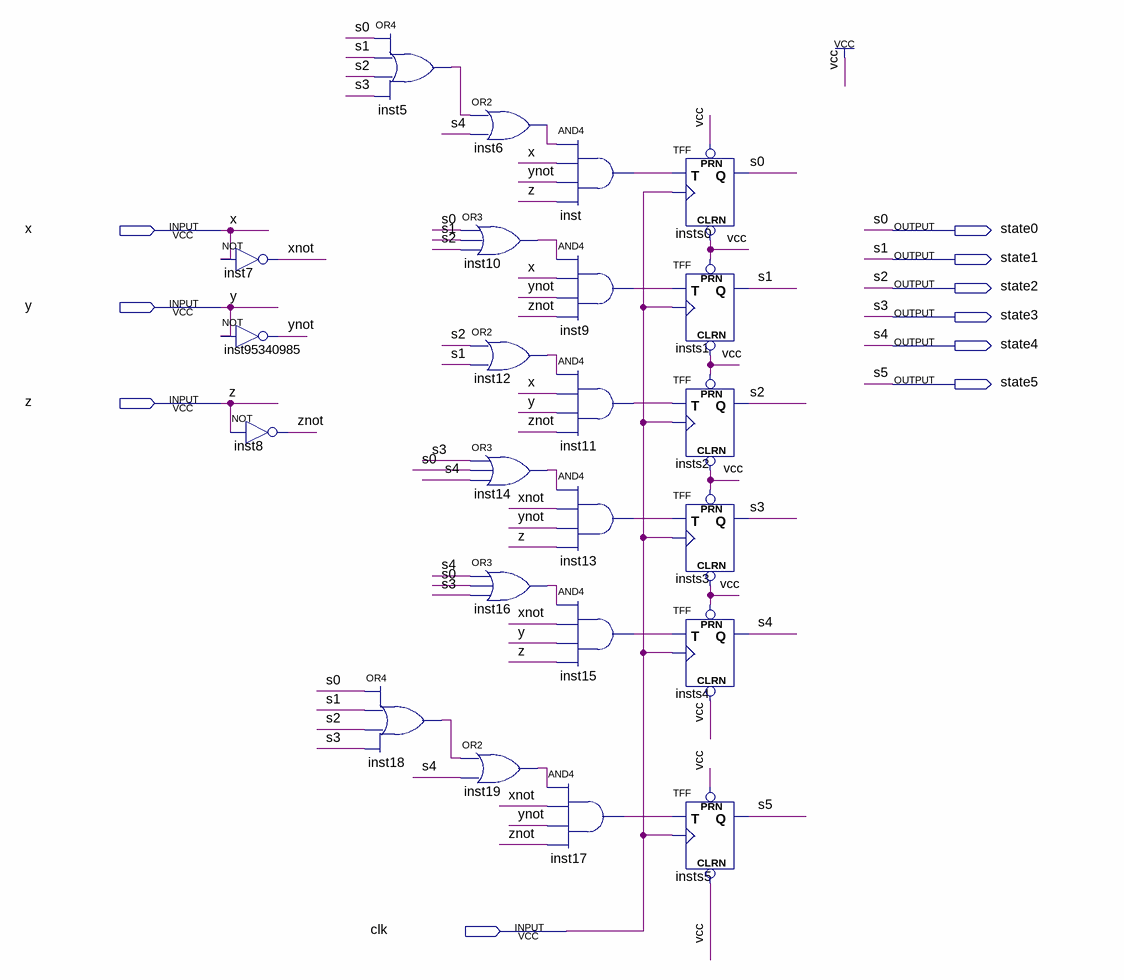
[diagram p0: schematic sheet]
// Quartus schematic StateMachine.bdf as structural Verilog: 23 symbols, 10 pins
module StateMachine (
  input  x,
  input  y,
  input  z,
  input  clk,
  output state0,
  output state1,
  output state2,
  output state3,
  output state4,
  output state5
);

  wire inst5_out, inst6_out, inst9_out, inst10_out, inst11_out, inst12_out, inst13_out, inst14_out,
       inst15_out, inst16_out, inst17_out, inst18_out, inst19_out, inst_out, xnot, ynot, znot;

  not inst7 (xnot, x);
  not inst95340985 (ynot, y);
  not inst8 (znot, z);
  or inst5 (inst5_out, state0, state1, state2, state3);
  or inst18 (inst18_out, state0, state1, state2, state3);
  or inst6 (inst6_out, inst5_out, state4);
  or inst10 (inst10_out, state0, state1, state2);
  or inst12 (inst12_out, state2, state1);
  or inst14 (inst14_out, state3, state0, state4);
  or inst16 (inst16_out, state4, state0, state3);
  or inst19 (inst19_out, inst18_out, state4);
  and inst (inst_out, inst6_out, x, ynot, z);
  and inst9 (inst9_out, inst10_out, x, ynot, znot);
  and inst11 (inst11_out, inst12_out, x, y, znot);
  and inst13 (inst13_out, inst14_out, xnot, ynot, z);
  and inst15 (inst15_out, inst16_out, xnot, y, z);
  and inst17 (inst17_out, inst19_out, xnot, ynot, znot);
  TFF insts0 (.PRN(1'b1), .CLRN(1'b1), .T(inst_out), .CLK(clk), .Q(state0));
  TFF insts1 (.PRN(1'b1), .CLRN(1'b1), .T(inst9_out), .CLK(clk), .Q(state1));
  TFF insts2 (.PRN(1'b1), .CLRN(1'b1), .T(inst11_out), .CLK(clk), .Q(state2));
  TFF insts3 (.PRN(1'b1), .CLRN(1'b1), .T(inst13_out), .CLK(clk), .Q(state3));
  TFF insts4 (.PRN(1'b1), .CLRN(1'b1), .T(inst15_out), .CLK(clk), .Q(state4));
  TFF insts5 (.PRN(1'b1), .CLRN(1'b1), .T(inst17_out), .CLK(clk), .Q(state5));

  // Other names for the same wires on the sheet: s0 = state0; s1 = state1; s2 = state2; s3 = state3; s4 = state4;
  //   s5 = state5
endmodule
